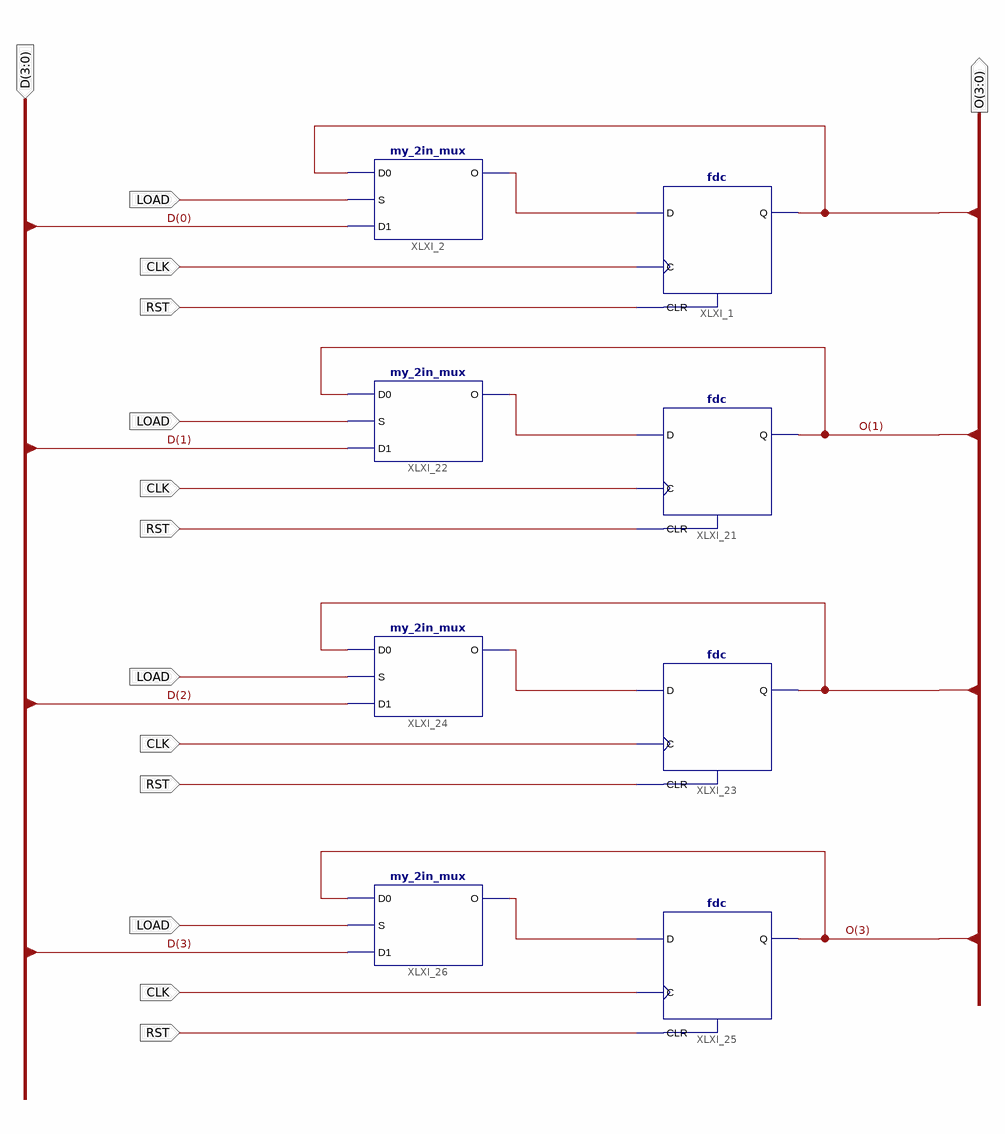
[diagram p0: schematic sheet 1]
// Xilinx ISE schematic my_register_4bit.sch (virtex6) as structural Verilog: 8 symbols, 5 ports
module my_register_4bit (
  input  CLK,
  input  RST,
  input  LOAD,
  input  [3:0] D,
  output [3:0] O
);

  wire XLXN_1, XLXN_63, XLXN_72, XLXN_78;

  my_2in_mux XLXI_2 (.D0(O[0]), .D1(D[0]), .O(XLXN_1), .S(LOAD));
  fdc XLXI_1 (.C(CLK), .CLR(RST), .D(XLXN_1), .Q(O[0]));
  fdc XLXI_21 (.C(CLK), .CLR(RST), .D(XLXN_63), .Q(O[1]));
  my_2in_mux XLXI_22 (.D0(O[1]), .D1(D[1]), .O(XLXN_63), .S(LOAD));
  fdc XLXI_23 (.C(CLK), .CLR(RST), .D(XLXN_72), .Q(O[2]));
  my_2in_mux XLXI_24 (.D0(O[2]), .D1(D[2]), .O(XLXN_72), .S(LOAD));
  fdc XLXI_25 (.C(CLK), .CLR(RST), .D(XLXN_78), .Q(O[3]));
  my_2in_mux XLXI_26 (.D0(O[3]), .D1(D[3]), .O(XLXN_78), .S(LOAD));
endmodule
